# Altium schematic sheet Thrust Stand Controller Revised.SchDoc
size A4; SheetNumber: 1; SheetTotal: 5
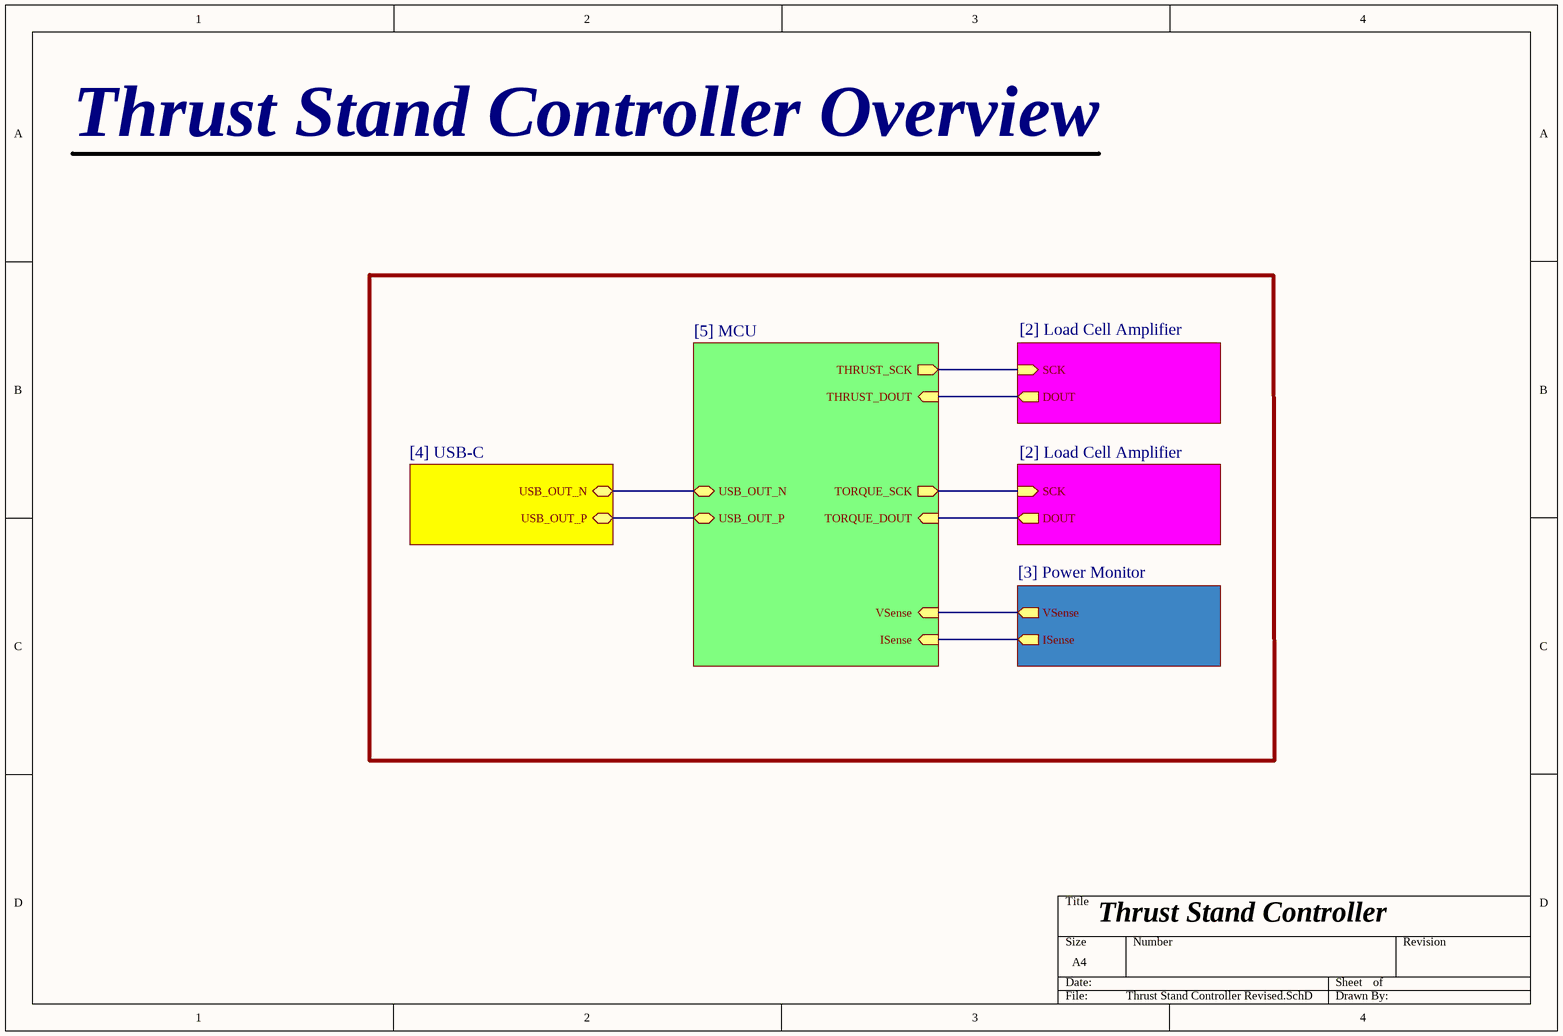
[diagram p0: Thrust Stand Controller Revised.SchDoc]

## Sub-sheets
[2] Load Cell Amplifier = Load Cell Amplifier.SchDoc: DOUT (out), SCK (in)
[2] Load Cell Amplifier = Load Cell Amplifier.SchDoc: DOUT (out), SCK (in)
[3] Power Monitor = Power Monitor.SchDoc: VSense (out), ISense (out)
[4] USB-C = USB-C.SchDoc: USB_OUT_N (bidir), USB_OUT_P (bidir)
[5] MCU = MCU.SchDoc: USB_OUT_N (bidir), USB_OUT_P (bidir), VSense (in), ISense (in), THRUST_SCK (out), THRUST_DOUT (in), TORQUE_SCK (out), TORQUE_DOUT (in)

## Nets
(unnamed): sheet [2] Load Cell Amplifier/DOUT, sheet [5] MCU/TORQUE_DOUT
(unnamed): sheet [2] Load Cell Amplifier/SCK, sheet [5] MCU/TORQUE_SCK
(unnamed): sheet [4] USB-C/USB_OUT_N, sheet [5] MCU/USB_OUT_N
(unnamed): sheet [4] USB-C/USB_OUT_P, sheet [5] MCU/USB_OUT_P
(unnamed): sheet [3] Power Monitor/VSense, sheet [5] MCU/VSense
(unnamed): sheet [3] Power Monitor/ISense, sheet [5] MCU/ISense
(unnamed): sheet [2] Load Cell Amplifier/DOUT, sheet [5] MCU/THRUST_DOUT
(unnamed): sheet [2] Load Cell Amplifier/SCK, sheet [5] MCU/THRUST_SCK

## Notes on the sheet
- Thrust Stand Controller Overview
- Thrust Stand Controller